# EAGLE design imu (EAGLE 9.6.2)
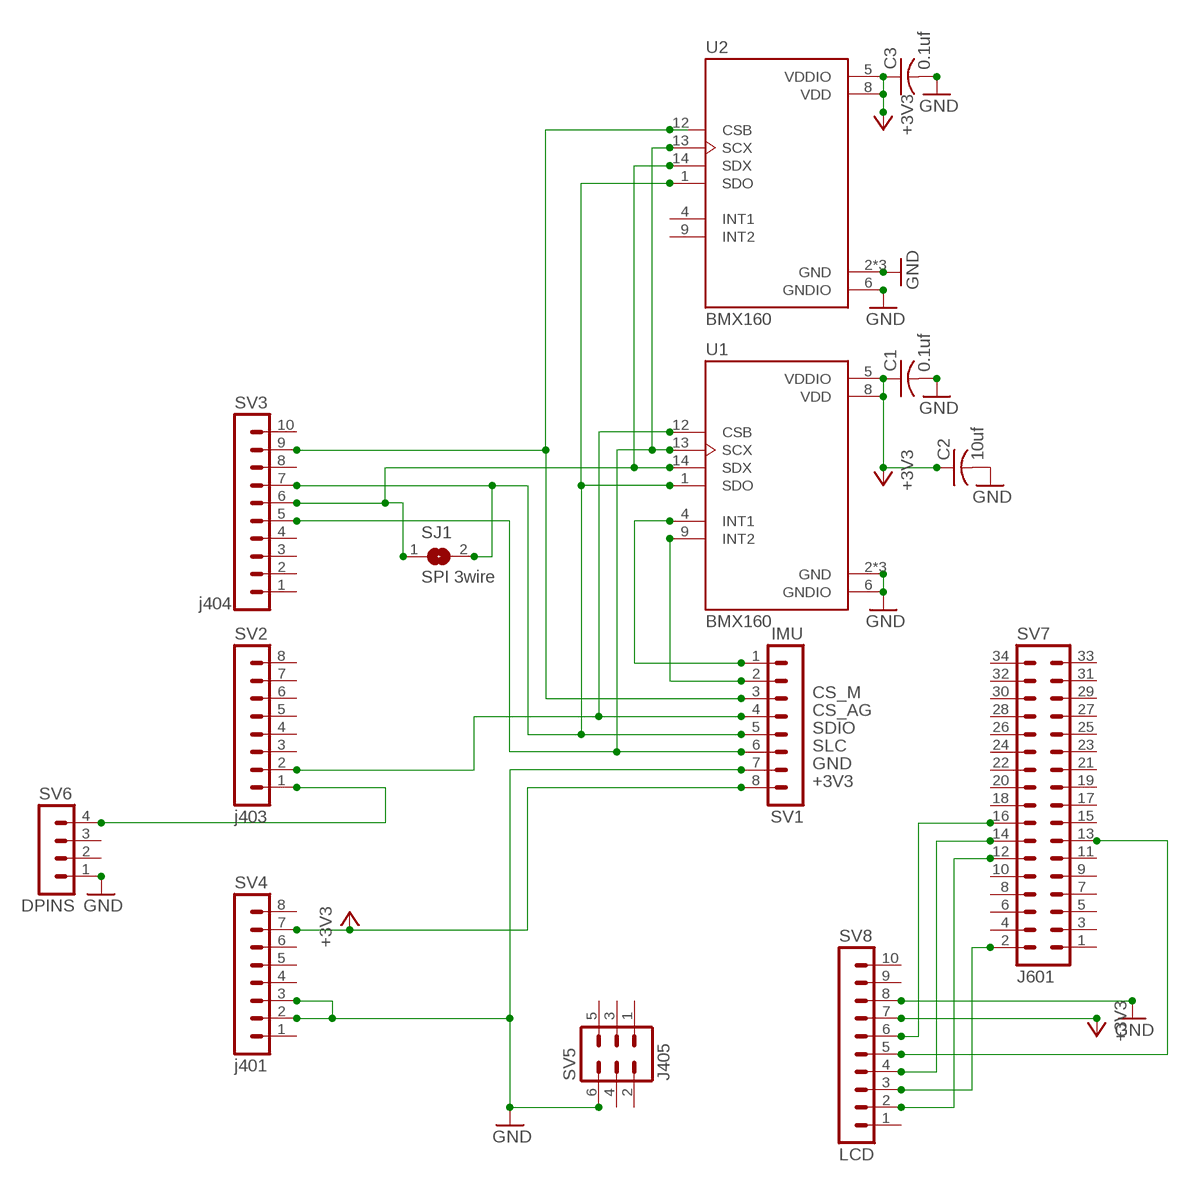
[diagram p0: schematic, sheet 1]

## Parts
C1  0.1uf  C-USC0805  [C0805]
C2  10uf  C-USC0805  [C0805]
C3  0.1uf  C-USC0805  [C0805]
SJ1  SPI 3wire  SJ  [SJ]
SV1  IMU  MA08-1  [MA08-1]
SV2  j403  MA08-1  [MA08-1]
SV3  j404  MA10-1  [MA10-1]
SV4  j401  MA08-1  [MA08-1]
SV5  J405  MA03-2  [MA03-2]
SV6  DPINS  MA04-1  [MA04-1]
SV7  J601  MA17-2W  [MA17-2W]
SV8  LCD  MA10-1  [MA10-1]
U1  BMX160  [PQFN50P250X300X100-14N]
U2  BMX160  [PQFN50P250X300X100-14N]

## Nets
+3V3: C1.1 C2.1 C3.1 SV1.8 SV4.7 SV8.7 U1.5(VDDIO) U1.8(VDD) U2.5(VDDIO) U2.8(VDD)
CS_AG: SV1.4 SV2.2 U1.12(CSB)
CS_M: SV1.3 SV3.9 U2.12(CSB)
GND: C1.2 C2.2 C3.2 SV1.7 SV4.2 SV4.3 SV5.6 SV6.1 SV8.8 U1.2(GND) U1.3(GND) U1.6(GNDIO) U1.7(GND) U2.2(GND) U2.3(GND) U2.6(GNDIO) U2.7(GND)
N$1: SV7.2 SV8.3
N$2: SV2.1 SV6.4
N$3: SV7.12 SV8.2
N$4: SV7.13 SV8.5
N$5: SV7.14 SV8.4
N$6: SV7.16 SV8.6
N$7: SJ1.1 SV3.6 U1.14(SDX) U2.14(SDX)
N$8: SV1.2 U1.9(INT2)
N$9: SV1.1 U1.4(INT1)
SDIO: SJ1.2 SV1.5 SV3.7 U1.1(SDO) U2.1(SDO)
SLC: SV1.6 SV3.5 U1.13(SCX) U2.13(SCX)
Unconnected: SV2.3 SV2.4 SV2.5 SV2.6 SV2.7 SV2.8 SV3.1 SV3.2 SV3.3 SV3.4 SV3.8 SV3.10 SV4.1 SV4.4 SV4.5 SV4.6 SV4.8 SV5.1 SV5.2 SV5.3 SV5.4 SV5.5 SV6.2 SV6.3 SV7.1 SV7.3 SV7.4 SV7.5 SV7.6 SV7.7 SV7.8 SV7.9 SV7.10 SV7.11 SV7.15 SV7.17 SV7.18 SV7.19 SV7.20 SV7.21 SV7.22 SV7.23 SV7.24 SV7.25 SV7.26 SV7.27 SV7.28 SV7.29 SV7.30 SV7.31 SV7.32 SV7.33 SV7.34 SV8.1 SV8.9 SV8.10 U2.4(INT1) U2.9(INT2)

## Library data of the parts
C1-C3 = rcl:C-US: CAPACITOR, American symbol; SPICEPREFIX: C
SJ1 = jumper:SJ: SMD solder JUMPER
SV1 SV2 SV4 = con-lstb:MA08-1: PIN HEADER; OC_FARNELL: unknown; OC_NEWARK: unknown
SV3 SV8 = con-lstb:MA10-1: PIN HEADER; OC_FARNELL: unknown; OC_NEWARK: unknown
SV5 = con-lstb:MA03-2: PIN HEADER; OC_FARNELL: unknown; OC_NEWARK: unknown
SV6 = con-lstb:MA04-1: PIN HEADER; OC_FARNELL: unknown; OC_NEWARK: unknown
SV7 = con-lstb:MA17-2W: PIN HEADER; OC_FARNELL: unknown; OC_NEWARK: unknown
U1 U2 = BMX160:BMX160: IMU ACCEL/GYRO/MAG Check prices <https://pricing.snapeda.com/parts/BMX160/Bosch%20Sensortec/view-part?ref=eda>; AVAILABILITY: Good; DESCRIPTION: Accelerometer, Gyroscope, Magnetometer, 9 Axis Sensor I²C, SPI Output; MF: Bosch Sensortec; MP: BMX160; PACKAGE: VFLGA-14 Bosch Sensortec; PRICE: None; PURCHASE-URL: https://pricing.snapeda.com/search/part/BMX160/?ref=eda

## Board
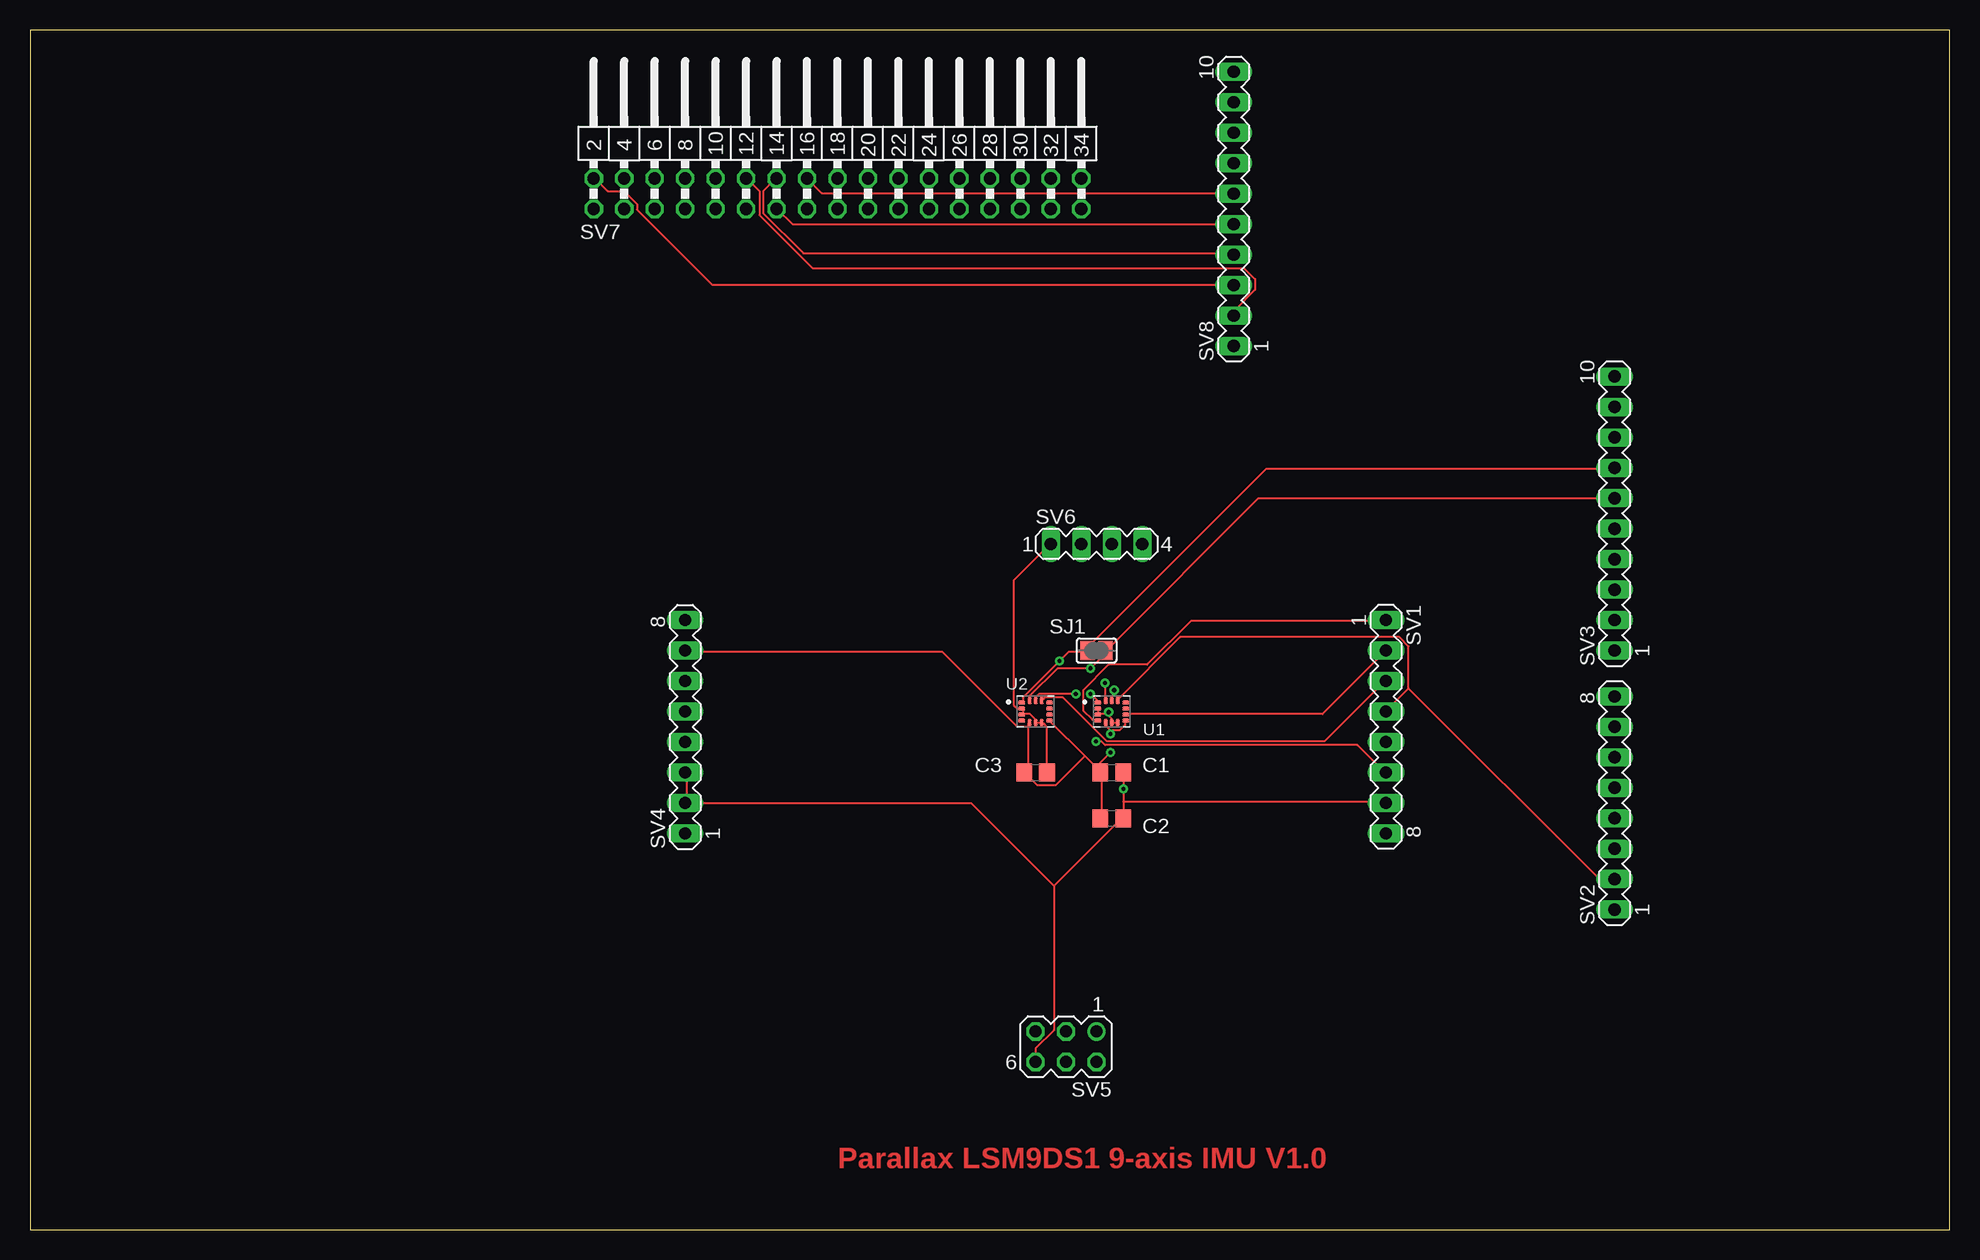
[diagram p1: board, top side]
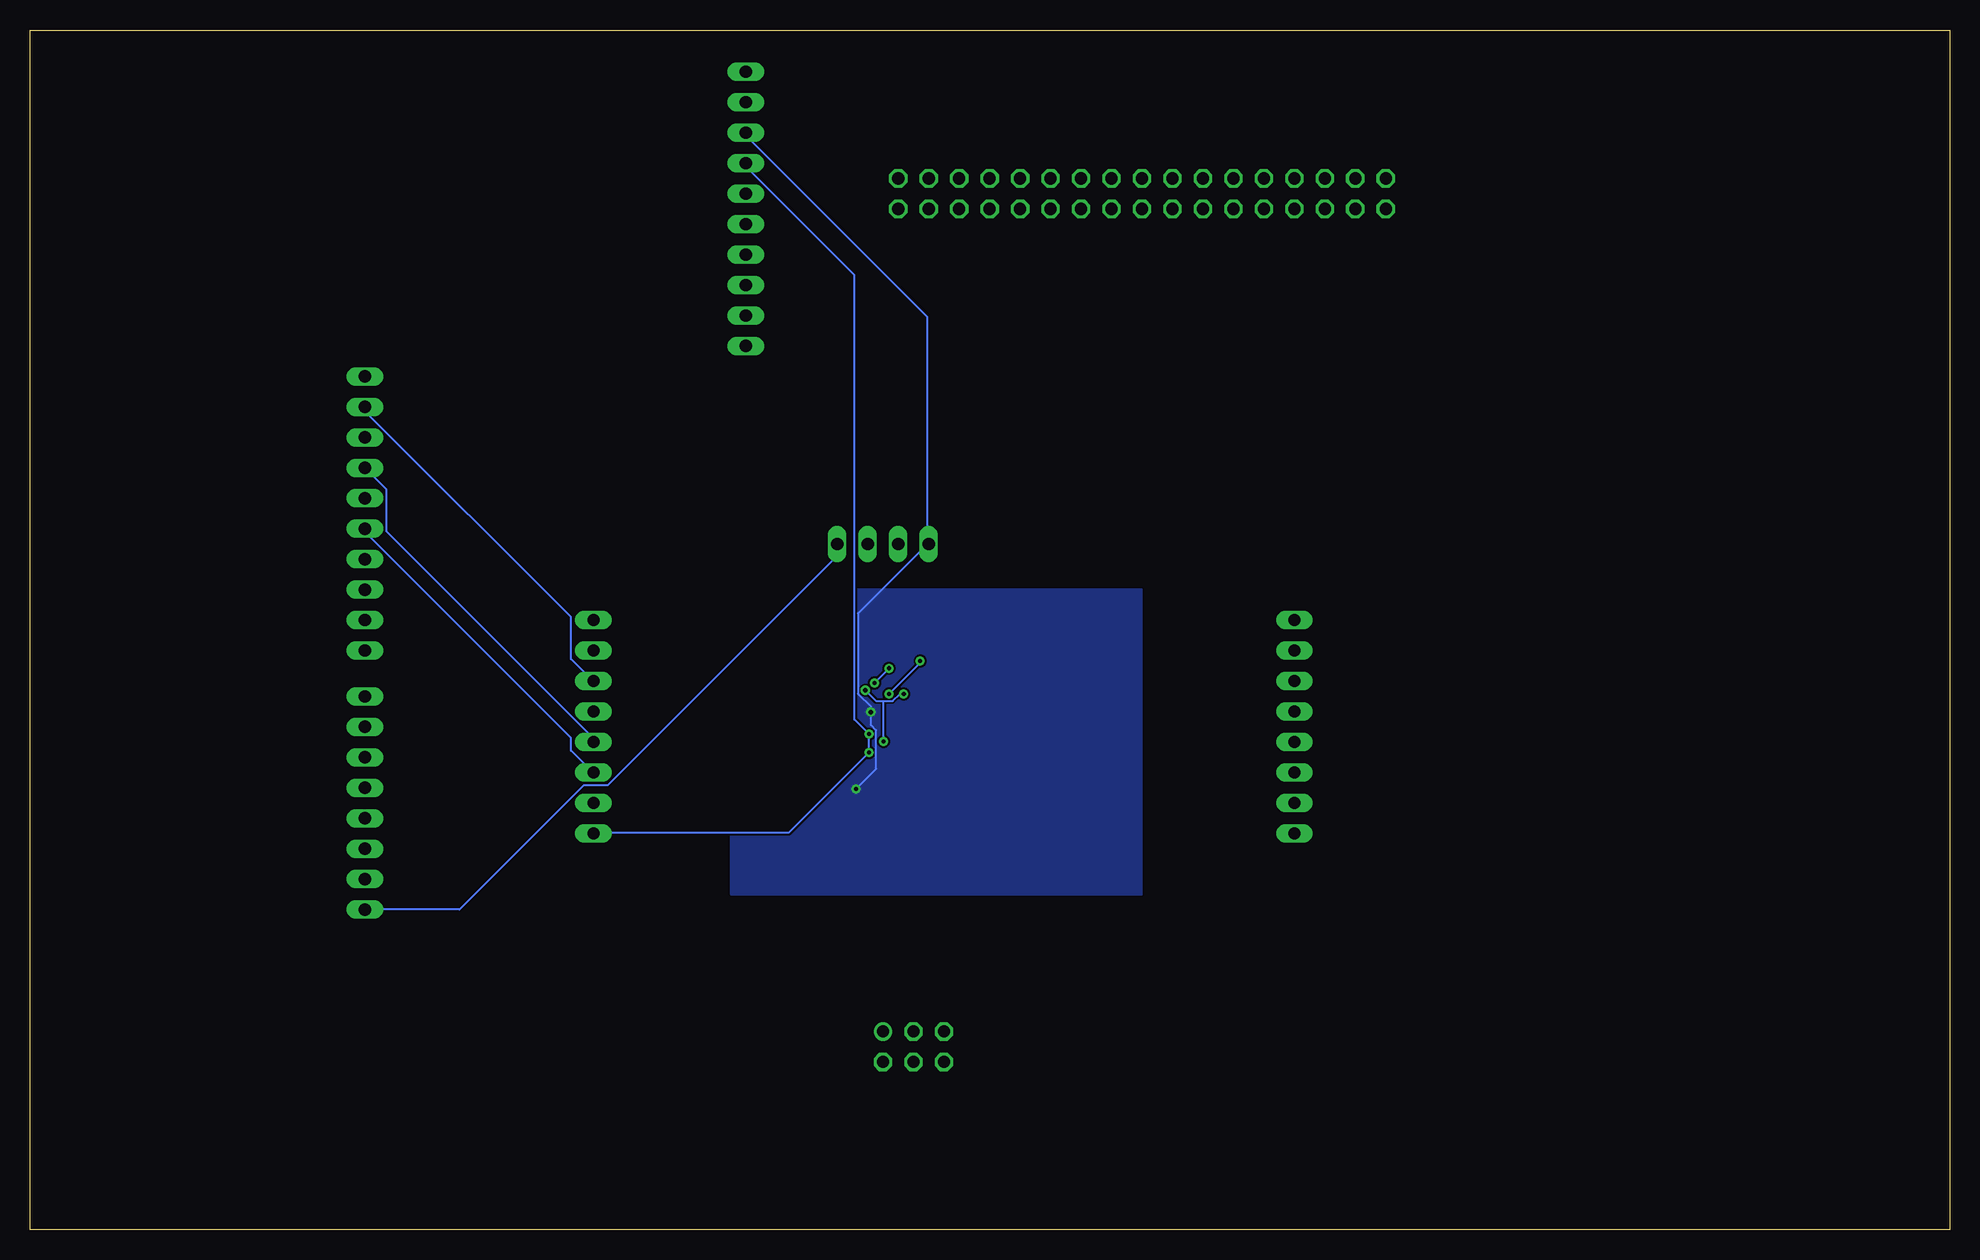
[diagram p2: board, bottom side, seen from below]

Size 160 x 100 mm. Coordinates in mm from the lower left corner, seen from the top.
Outline: 0,0 160,0 160,100 0,100 0,0
Copper layers (1*16): Top 0.035mm / dielectric 1.5mm / Bottom 0.035mm
Design rules "default": minimum track width 6mil, minimum drill 0.35mm, track to track 6mil, track to pad 6mil, pad to pad 6mil, via to via 6mil, smd to smd 6mil, copper to edge 40mil, drill to drill 6mil, minimum pad ring 10mil, minimum via ring 8mil, stop-mask expansion 4mil, vias tented up to drill 0mil, thermal gap 10mil

### Footprints (pad centres in the part's own frame; a part is rotated, then mirrored left to right if it is on the bottom)
C0805 = smd 1.3 x 1.5: 1 -0.95,0; 2 0.95,0
SJ = smd 1.168 x 1.6: 1 -0.762,0; 2 0.762,0
MA08-1 = drill 1.016 long: 1 -8.89,0; 2 -6.35,0; 3 -3.81,0; 4 -1.27,0; 5 1.27,0; 6 3.81,0; 7 6.35,0; 8 8.89,0
MA10-1 = drill 1.016 long: 1 -11.43,0; 2 -8.89,0; 3 -6.35,0; 4 -3.81,0; 5 -1.27,0; 6 1.27,0; 7 3.81,0; 8 6.35,0; 9 8.89,0; 10 11.43,0
MA03-2 = drill 1.016: 1 -2.54,-1.27 | drill 1.016 octagon: 2 -2.54,1.27; 3 0,-1.27; 4 0,1.27; 5 2.54,-1.27; 6 2.54,1.27
MA04-1 = drill 1.016 long: 1 -3.81,0; 2 -1.27,0; 3 1.27,0; 4 3.81,0
MA17-2W = drill 1.016 octagon: 1 -20.32,-1.27; 2 -20.32,1.27; 3 -17.78,-1.27; 4 -17.78,1.27; 5 -15.24,-1.27; 6 -15.24,1.27; 7 -12.7,-1.27; 8 -12.7,1.27; 9 -10.16,-1.27; 10 -10.16,1.27; 11 -7.62,-1.27; 12 -7.62,1.27; 13 -5.08,-1.27; 14 -5.08,1.27; 15 -2.54,-1.27; 16 -2.54,1.27; 17 0,-1.27; 18 0,1.27; 19 2.54,-1.27; 20 2.54,1.27; 21 5.08,-1.27; 22 5.08,1.27; 23 7.62,-1.27; 24 7.62,1.27; 25 10.16,-1.27; 26 10.16,1.27; 27 12.7,-1.27; 28 12.7,1.27; 29 15.24,-1.27; 30 15.24,1.27; 31 17.78,-1.27; 32 17.78,1.27; 33 20.32,-1.27; 34 20.32,1.27
PQFN50P250X300X100-14N = smd 0.58 x 0.35: 1 -1.16,0.75; 2 -1.16,0.25; 3 -1.16,-0.25; 4 -1.16,-0.75; 8 1.16,-0.75; 9 1.16,-0.25; 10 1.16,0.25; 11 1.16,0.75 | smd 0.35 x 0.58: 5 -0.5,-0.91; 6 0,-0.91; 7 0.5,-0.91; 12 0.5,0.91; 13 0,0.91; 14 -0.5,0.91

### Placement (x,y rotation side)
C1  90.17,38.1 0 top
C2  90.17,34.29 0 top
C3  83.82,38.1 0 top
SJ1  88.9,48.26 180 top
SV1  113.03,41.91 270 top
SV2  132.08,35.56 90 top
SV3  132.08,59.69 90 top
SV4  54.61,41.91 90 top
SV5  86.36,15.24 180 top
SV6  88.9,57.15 0 top
SV7  67.31,86.36 0 top
SV8  100.33,85.09 90 top
U1  90.17,43.18 0 top
U2  83.82,43.18 0 top

### Tracks (layer width: path | path; a pad name or v marks a point on that pad's centre or on a via)
+3V3  (via drill 0.35)
  Top 0.152: 83.21,41.91 83.21,38.41 82.91,38.1 | 83.21,41.91 83.21,42.22 U2.5 | 90.07,41.6 89.76,41.91 89.76,42.22 U1.5 | 90.07,41.6 90.83,41.6 91.29,42.06 91.29,42.37 U1.8 | 89.31,38.1 88.85,38.56 | 88.85,38.56 87.94,39.47 | 87.94,39.47 85.04,42.37 U2.8 | v90.07,41.3 90.07,41.6 | 88.85,38.56 v90.07,39.78 | 88.85,38.56 C1.1 89.31,38.1 | 89.31,38.1 89.31,34.29 C2.1 | 82.91,38.1 83.97,37.03 85.5,37.03 87.94,39.47 | 82.91,38.1 C3.1 | 83.21,41.91 82.3,41.91 76.05,48.16 54.71,48.16 SV4.7
  Bottom 0.152: SV8.7 100.28,88.85 100.28,88.54 91.29,79.55 91.29,42.52 v90.07,41.3 v90.07,39.78 96.77,33.07 112.93,33.07 SV1.8
CS_AG
  Top 0.152: 114.91,45.11 114.91,48.62 114.15,49.38 95.86,49.38 90.68,44.2 U1.12 | 114.91,45.11 113.08,43.28 SV1.4 | 114.91,45.11 130.76,29.26 131.98,29.26 SV2.2
CS_M
  Top 0.152: U2.12 84.43,44.2 84.58,44.35 86.11,44.35 89.76,40.69 107.9,40.69 112.93,45.72 SV1.3
  Bottom 0.152: SV3.9 131.98,68.58 131.98,68.12 114.91,51.05 114.91,47.55 113.08,45.72 SV1.3
GND  (via drill 0.35)
  Top 0.152: 82.75,42.98 82.75,43.28 U2.2 82.6,43.43 82.3,43.43 81.99,43.74 81.99,54.1 85.04,57.15 SV6.1 | 82.75,42.98 83.36,42.98 83.82,42.52 U2.6 83.82,42.22 84.28,42.22 U2.7 84.43,42.22 84.73,41.91 84.73,38.1 C3.2 | 82.75,42.98 U2.3 | U1.2 89,43.28 89,42.98 U1.3 89.15,42.98 89.76,42.98 | U1.7 90.53,42.22 90.22,42.22 U1.6 90.22,42.37 90.22,42.52 89.76,42.98 | v89.92,43.13 89.76,42.98 | SV4.3 54.71,38.1 54.71,35.66 SV4.2 54.71,35.51 78.49,35.51 85.34,28.65 | 91.14,35.66 v91.14,36.73 91.14,38.1 C1.2 | 91.14,35.66 91.14,34.29 C2.2 90.98,34.29 85.34,28.65 | 91.14,35.66 112.93,35.66 SV1.7 | SV5.6 83.82,15.09 85.34,16.61 85.34,28.65
  Bottom 0.152: 85.19,57.15 90.98,51.36 90.98,44.65 89.92,43.59 v89.92,43.13 89.92,42.06 89.46,41.6 89.46,38.41 v91.14,36.73 | 85.19,57.15 85.19,76.05 100.28,91.14 100.28,91.44 SV8.8 | 85.19,57.15 SV6.1
  pour Bottom: 67.31,53.34 101.6,53.34 101.6,27.94 67.31,27.94
N$1
  Top 0.152: SV8.3 100.28,78.79 56.84,78.79 50.6,85.04 50.6,85.5 49.53,86.56 48.16,86.56 47.09,87.63 SV7.2
N$2
  Bottom 0.152: SV2.1 124.21,26.67 113.84,37.03 111.86,37.03 92.81,56.08 92.81,57.15 SV6.4
N$3
  Top 0.152: SV8.2 100.43,76.2 100.43,76.66 102.11,78.33 102.11,79.25 101.19,80.16 65.23,80.16 60.81,84.58 60.81,86.56 59.74,87.63 SV7.12
N$4
  Top 0.152: SV8.5 63.55,83.82 62.33,85.04 SV7.13
N$5
  Top 0.152: SV8.4 100.28,81.38 64.47,81.38 61.11,84.73 61.11,86.56 62.18,87.63 SV7.14
N$6
  Top 0.152: SV7.16 65.99,86.41 100.28,86.41 SV8.6
N$7  (via drill 0.35)
  Top 0.152: U2.14 83.36,44.2 83.36,44.5 85.65,46.79 v88.39,46.79 89.76,48.16 SJ1.1 89.76,48.31 102.41,60.96 SV3.6 | v89.61,45.57 89.61,44.2 U1.14
  Bottom 0.152: v88.39,46.79 v89.61,45.57
N$8
  Top 0.152: SV1.2 107.75,42.98 91.44,42.98 U1.9
N$9
  Top 0.152: U1.4 89,42.52 88.54,42.52 87.78,43.28 87.78,44.96 89.92,47.09 93.12,47.09 96.77,50.75 112.93,50.75 SV1.1
SDIO  (via drill 0.35)
  Top 0.152: U2.1 82.75,44.04 82.75,44.35 v85.8,47.4 86.56,48.16 88.09,48.16 SJ1.2 88.24,48.31 88.24,48.62 103.02,63.4 131.98,63.4 SV3.7 | v88.39,44.65 89,44.04 U1.1
  Bottom 0.152: v88.39,44.65 85.8,47.24 v85.8,47.4 | SV3.7 130.3,61.72 130.3,58.22 113.08,41 113.08,40.69 SV1.5
SLC  (via drill 0.35)
  Top 0.152: U2.13 83.82,44.35 84.12,44.65 v87.17,44.65 | v90.37,44.96 90.37,44.65 90.22,44.5 90.22,44.2 U1.13 | v88.85,40.69 89.31,40.69 89.61,40.39 110.64,40.39 112.93,38.1 SV1.6
  Bottom 0.152: v87.17,44.65 87.48,44.65 88.09,44.04 88.85,44.04 | 88.85,44.04 89.46,44.04 v90.37,44.96 | v88.85,40.69 88.85,44.04 | SV3.5 131.98,58.37 131.98,58.06 114.91,41 114.91,39.93 113.08,38.1 SV1.6

### Text on the board
Top: Parallax LSM9DS1 9-axis IMU V1.0